# EAGLE design SwitchMult_R2_0 (EAGLE 6.6.0)
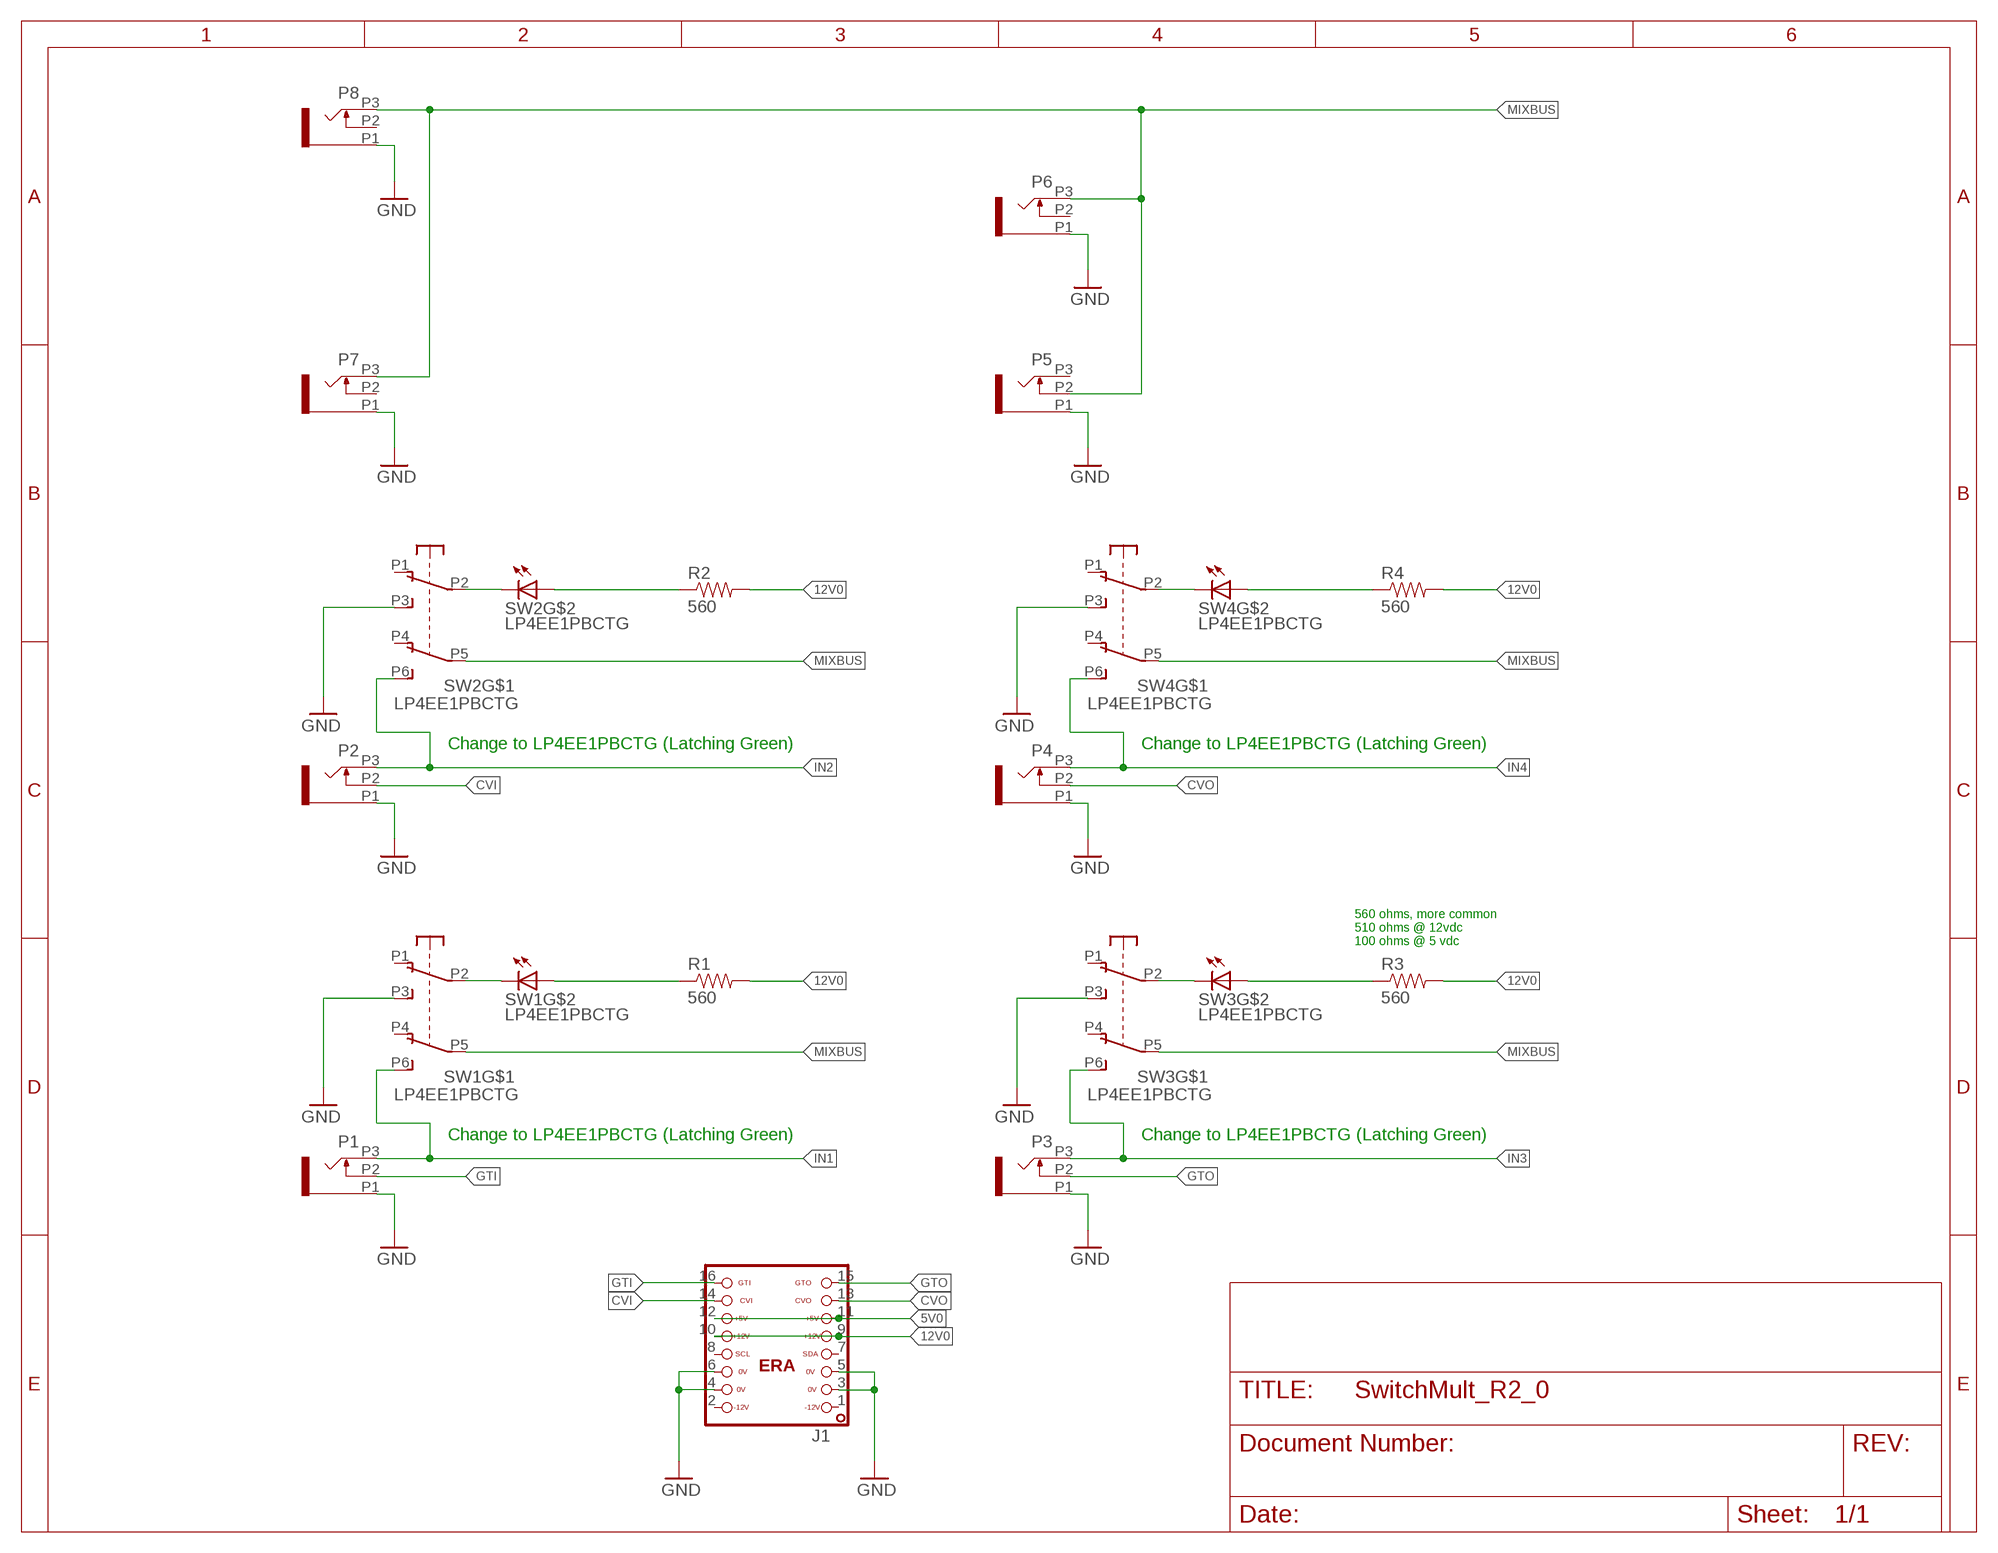
[diagram p0: schematic, sheet 1]

## Parts
J1  ERA-SHROUD  [ERA]
P1  PJ301_THONKICONN6  [WQP_PJ_301M6]
P2  PJ301_THONKICONN6  [WQP_PJ_301M6]
P3  PJ301_THONKICONN6  [WQP_PJ_301M6]
P4  PJ301_THONKICONN6  [WQP_PJ_301M6]
P5  PJ301_THONKICONN6  [WQP_PJ_301M6]
P6  PJ301_THONKICONN6  [WQP_PJ_301M6]
P7  PJ301_THONKICONN6  [WQP_PJ_301M6]
P8  PJ301_THONKICONN6  [WQP_PJ_301M6]
R1  560  RESISTORPTH-1/4W  [AXIAL-0.4]
R2  560  RESISTORPTH-1/4W  [AXIAL-0.4]
R3  560  RESISTORPTH-1/4W  [AXIAL-0.4]
R4  560  RESISTORPTH-1/4W  [AXIAL-0.4]
SW1  LP4EE1PBCTG  LP4OA1PBCT  [LP4OA1PBCT]
SW2  LP4EE1PBCTG  LP4OA1PBCT  [LP4OA1PBCT]
SW3  LP4EE1PBCTG  LP4OA1PBCT  [LP4OA1PBCT]
SW4  LP4EE1PBCTG  LP4OA1PBCT  [LP4OA1PBCT]

## Nets
5V0: J1.11 J1.12
12V0: J1.9 J1.10 R1.P$2 R2.P$2 R3.P$2 R4.P$2
CVI: J1.14 P2.P2
CVO: J1.13 P4.P2
GND: J1.3 J1.4 J1.5 J1.6 P1.P1 P2.P1 P3.P1 P4.P1 P5.P1 P6.P1 P7.P1 P8.P1 SW1.P3(A3) SW2.P3(A3) SW3.P3(A3) SW4.P3(A3)
GTI: J1.16 P1.P2
GTO: J1.15 P3.P2
IN1: P1.P3 SW1.P6(B3)
IN2: P2.P3 SW2.P6(B3)
IN3: P3.P3 SW3.P6(B3)
IN4: P4.P3 SW4.P6(B3)
MIXBUS: P5.P2 P6.P3 P7.P3 P8.P3 SW1.P5(B2) SW2.P5(B2) SW3.P5(B2) SW4.P5(B2)
N$1: SW1.L2 SW1.P2(A2)
N$2: SW2.L2 SW2.P2(A2)
N$3: R1.P$1 SW1.L1
N$4: R2.P$1 SW2.L1
N$5: SW3.L2 SW3.P2(A2)
N$6: R3.P$1 SW3.L1
N$7: SW4.L2 SW4.P2(A2)
N$8: R4.P$1 SW4.L1
Unconnected: J1.1 J1.2 J1.7 J1.8 P5.P3 P6.P2 P7.P2 P8.P2 SW1.P1(A1) SW1.P4(B1) SW2.P1(A1) SW2.P4(B1) SW3.P1(A1) SW3.P4(B1) SW4.P1(A1) SW4.P4(B1)

## Notes on the sheet
- Change to LP4EE1PBCTG (Latching Green) | Change to LP4EE1PBCTG (Latching Green)
- 560 ohms, more common
  510 ohms @ 12vdc
  100 ohms @ 5 vdc
- Change to LP4EE1PBCTG (Latching Green) | Change to LP4EE1PBCTG (Latching Green)

## Library data of the parts
J1 = ERA:ERA: EuroRack2 - Backplane Connector
P1-P8 = og-pj301:PJ301_THONKICONN
R1-R4 = halcyonmod_Passives:RESISTOR: Resistor Basic schematic elements and footprints for 0603, 1206, and PTH resistors.
SW1-SW4 = og-switch:LP4OA1PBCT

## Board
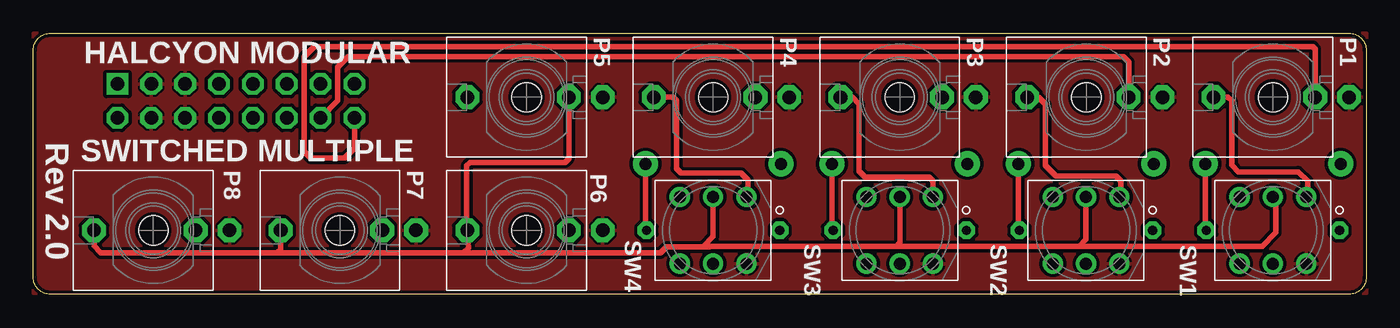
[diagram p1: board, top side]
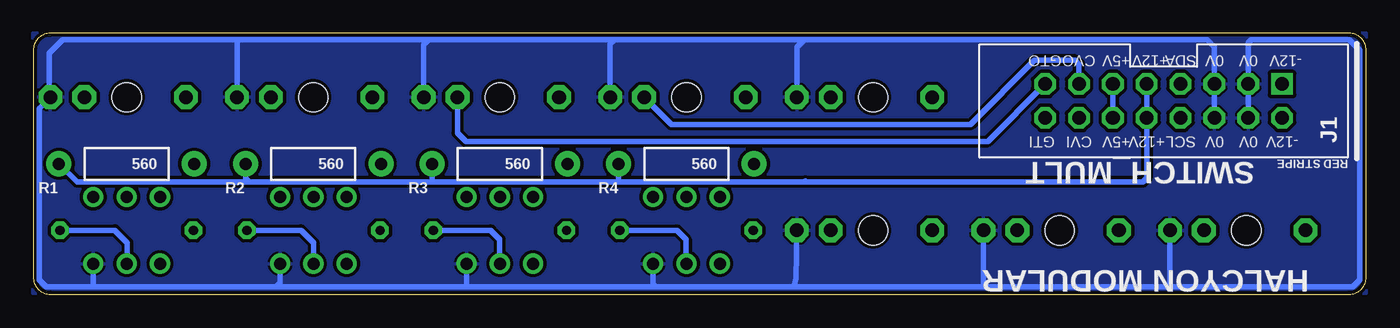
[diagram p2: board, bottom side, seen from below]

Size 100 x 19.6 mm. Coordinates in mm from the lower left corner, seen from the top.
Outline: 98.72,0 1.28,0 arc-90 0,1.28 0,18.32 arc-90 1.28,19.6 98.72,19.6 arc-90 100,18.32 100,1.28 arc-90 98.72,0
Copper layers (1*16): Top 0.035mm / dielectric 1.5mm / Bottom 0.035mm
Design rules "PatternAgents_7mil": minimum track width 7mil, minimum drill 14mil, track to track 7mil, track to pad 7mil, pad to pad 7mil, via to via 7mil, smd to smd 7mil, copper to edge 7mil, drill to drill 7mil, minimum pad ring 12mil, minimum via ring 10mil, stop-mask expansion 4mil, vias tented up to drill 25mil, thermal gap 7mil

### Footprints (pad centres in the part's own frame; a part is rotated, then mirrored left to right if it is on the bottom)
ERA = drill 1.016 square: 1 -8.89,-1.27 | drill 1.016 octagon: 2 -8.89,1.27; 3 -6.35,-1.27; 4 -6.35,1.27; 5 -3.81,-1.27; 6 -3.81,1.27; 7 -1.27,-1.27; 8 -1.27,1.27; 9 1.27,-1.27; 10 1.27,1.27; 11 3.81,-1.27; 12 3.81,1.27; 13 6.35,-1.27; 14 6.35,1.27; 15 8.89,-1.27; 16 8.89,1.27
WQP_PJ_301M6 = drill 1.016 pad 1.778 octagon: P1 0,-5.715; P2 0,-3.175; P3 0,4.445 | hole 2.2: 0,0
AXIAL-0.4 = drill 0.9 pad 1.88: P$1 -5.08,0; P$2 5.08,0
LP4OA1PBCT = drill 0.7 octagon: L1 5,0; L2 -5,0 | drill 0.9: P1 2.5,2.5; P2 0,2.5; P3 -2.5,2.5; P4 2.5,-2.5; P5 0,-2.5; P6 -2.5,-2.5

### Placement (x,y rotation side)
J1  15.2,14.52 180 bottom
P1  93,14.8 90 top
P2  79,14.8 90 top
P3  65,14.8 90 top
P4  51,14.8 90 top
P5  37,14.8 90 top
P6  37,4.8 90 top
P7  23,4.8 90 top
P8  9,4.8 90 top
R1  93,9.8 180 bottom
R2  79,9.8 180 bottom
R3  65,9.8 180 bottom
R4  51,9.8 180 bottom
SW1  93,4.8 180 top
SW2  78.98,4.8 180 top
SW3  65,4.8 180 top
SW4  51,4.8 180 top

### Tracks (layer width: path | path; a pad name or v marks a point on that pad's centre or on a via)
5V0
  Bottom 0.406: J1.11 J1.12
12V0
  Bottom 0.406: J1.9 J1.10 16.47,8.72 16.75,8.44 42.15,8.44 | 42.15,8.44 56.12,8.44 | 56.12,8.44 70.09,8.44 | 70.09,8.44 83.81,8.44 | 83.81,8.44 96.72,8.44 R1.P$2 | R2.P$2 84.08,8.71 83.81,8.44 | R3.P$2 70.08,8.45 70.09,8.44 | R4.P$2 56.08,8.48 56.12,8.44 | 42.08,8.51 42.15,8.44
CVI
  Top 0.406: P2.P2 82.17,17.43 81.77,17.83 23.61,17.83 22.85,17.07 22.85,14.55 J1.14
CVO
  Bottom 0.406: J1.13 21.55,17.3 21.83,17.58 24.88,17.58 29.7,12.75 52.13,12.75 P4.P2
GND
  Bottom 0.406: J1.4 J1.3 8.85,18.88 8.62,19.1 1.26,19.1 0.49,18.34 0.49,1.07 1,0.56 14.97,0.56 | 14.97,0.56 28.69,0.56 | 28.69,0.56 42.93,0.56 | 42.93,0.56 53.33,0.56 | 53.33,0.56 67.55,0.56 | 67.55,0.56 81.77,0.56 | 81.77,0.56 95.49,0.56 | 95.49,0.56 99.05,0.56 99.55,1.07 99.55,13.96 P1.P1 98.79,14.88 98.79,18.09 97.78,19.1 84.57,19.1 | 42.15,19.1 11.92,19.1 11.39,18.57 J1.5 J1.6 | 42.15,19.1 56.37,19.1 | 56.37,19.1 70.34,19.1 | 70.34,19.1 84.57,19.1 | SW1.P3 95.5,0.57 95.49,0.56 | SW2.P3 81.48,0.85 81.77,0.56 | SW3.P3 67.5,0.61 67.55,0.56 | SW4.P3 53.5,0.74 53.33,0.56 | P7.P1 28.71,0.59 28.69,0.56 | P8.P1 14.71,0.82 14.97,0.56 | P2.P1 84.72,18.96 84.57,19.1 | P3.P1 70.72,18.73 70.34,19.1 | P4.P1 56.72,18.76 56.37,19.1 | P5.P1 42.72,18.54 42.15,19.1 | P6.P1 42.8,1.2 42.93,0.56
  pour Top (isolate 0.254, hatched): -0.01,0.05 -0.01,19.61 100.06,19.61 100.06,0.05
  pour Bottom (isolate 0.254, hatched): -0.01,0.05 -0.01,19.61 100.06,19.61 100.06,0.05
GTI
  Top 0.406: P1.P2 96.17,18.42 96,18.6 21.07,18.6 20.31,17.83 20.31,10.72 20.81,10.21 23.35,10.21 24.12,10.98 24.12,13.22 J1.16
GTO
  Bottom 0.406: P3.P2 68.17,12.11 67.55,11.48 28.39,11.48 J1.15
IN1
  Top 0.406: P1.P3 89.63,14.8 89.9,14.53 89.9,9.7 90.4,9.2 94.9,9.2 95.6,8.5 95.6,7.4 SW1.P6
IN2
  Top 0.406: P2.P3 75.41,14.8 75.93,14.28 75.93,9.67 76.7,8.9 81.2,8.9 81.6,8.5 81.6,7.42 SW2.P6
IN3
  Top 0.406: P3.P3 61.44,14.8 61.96,14.28 61.96,9.24 62.4,8.8 67.2,8.8 67.5,8.5 SW3.P6
IN4
  Top 0.406: P4.P3 47.98,14.8 48.25,14.53 48.25,9.45 48.6,9.1 53.1,9.1 53.6,8.6 53.6,7.4 SW4.P6
MIXBUS
  Top 0.406: P8.P3 4.55,3.61 5.07,3.1 18.27,3.1 | 18.27,3.1 32.26,3.1 | 32.26,3.1 47.04,3.1 47.5,3.56 50.75,3.56 50.8,3.61 | 50.8,3.61 50.28,3.61 51,4.33 SW4.P5 | 50.8,3.61 64.76,3.61 | 64.76,3.61 78.47,3.61 | 78.47,3.61 92.19,3.61 93.2,4.63 93.2,7.1 SW1.P5 | SW2.P5 78.98,4.12 78.47,3.61 | SW3.P5 65,3.85 64.76,3.61 | P7.P3 18.55,3.38 18.27,3.1 | P5.P2 40.17,10.2 39.88,9.91 32.77,9.91 32.51,9.65 32.51,4.95 P6.P3 32.64,3.48 32.26,3.1
N$1
  Bottom 0.406: SW1.L2 93.89,4.8 92.95,3.86 92.95,2.35 SW1.P2
N$2
  Bottom 0.406: SW2.L2 79.92,4.8 78.98,3.86 SW2.P2
N$3
  Top 0.406: R1.P$1 87.92,4.88 SW1.L1
N$4
  Top 0.406: R2.P$1 73.92,4.86 SW2.L1
N$5
  Bottom 0.406: SW3.L2 65.69,4.8 65.01,4.12 SW3.P2
N$6
  Top 0.406: R3.P$1 59.92,4.88 SW3.L1
N$7
  Bottom 0.406: SW4.L2 51.72,4.8 51.04,4.12 51.04,2.34 SW4.P2
N$8
  Top 0.406: R4.P$1 45.92,4.88 SW4.L1

### Text on the board
tPlace: HALCYON MODULAR | Rev 2.0 | SWITCHED MULTIPLE
bPlace: SWITCH_MULT | HALCYON MODULAR